# Altium schematic sheet Glucometer-E.C.- Full V1.SchDoc
size Letter
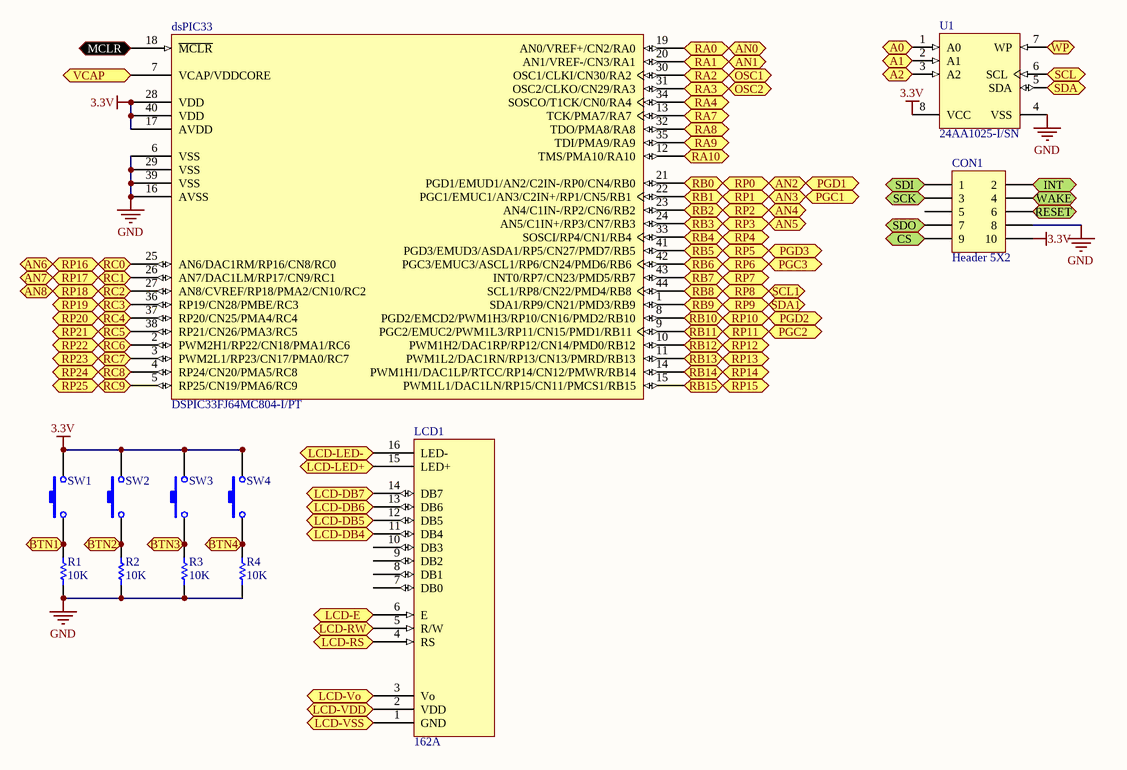
[diagram p0: Glucometer-E.C.- Full V1.SchDoc]

## Parts
CON1  Header 5X2  [HDR2X5]
dsPIC33  DSPIC33FJ64MC804-I/PT  [TQFP-PT44_N]
LCD1  162A  [162A]
R1  value 10K  [AXIAL-0.3]  (hidden comment: Res1)
R2  value 10K  [AXIAL-0.3]  (hidden comment: Res1)
R3  value 10K  [AXIAL-0.3]  (hidden comment: Res1)
R4  value 10K  [AXIAL-0.3]  (hidden comment: Res1)
SW1  SW-PB  [SPST-2]  (value not drawn)
SW2  SW-PB  [SPST-2]  (value not drawn)
SW3  SW-PB  [SPST-2]  (value not drawn)
SW4  SW-PB  [SPST-2]  (value not drawn)
U1  24AA1025-I/SN  [SOIC-SN8_N]

## Ports
A0, A1, A2, AN0, AN1, AN2, AN3, AN4, AN5, AN6, AN7, AN8, BTN1, BTN2, BTN3, BTN4, CS, INT, LCD-DB4, LCD-DB5, LCD-DB6, LCD-DB7, LCD-E, LCD-LED+, LCD-LED-, LCD-RS, LCD-RW, LCD-VDD, LCD-Vo, LCD-VSS, MCLR, OSC1, OSC2, PGC1, PGC2, PGC3, PGD1, PGD2, PGD3, RA0, RA1, RA2, RA3, RA4, RA7, RA8, RA9, RA10, RB0, RB1, RB2, RB3, RB4, RB5, RB6, RB7, RB8, RB9, RB10, RB11, RB12, RB13, RB14, RB15, RC0, RC1, RC2, RC3, RC4, RC5, RC6, RC7, RC8, RC9, RESET, RP0, RP1, RP2, RP3, RP4, RP5, RP6, RP7, RP8, RP9, RP10, RP11, RP12, RP13, RP14, RP15, RP16, RP17, RP18, RP19, RP20, RP21, RP22, RP23, RP24, RP25, SCK, SCL, SCL1, SDA, SDA1, SDI, SDO, VCAP, WAKE, WP

## Nets
3.3V: CON1.10 dsPIC33.17(AVDD) dsPIC33.28(VDD) dsPIC33.40(VDD) SW1.2 SW2.2 SW3.2 SW4.2 U1.8(VCC)
GND: CON1.8 dsPIC33.6(VSS) dsPIC33.16(AVSS) dsPIC33.29(VSS) dsPIC33.39(VSS) R1.1 R2.1 R3.1 R4.1 U1.4(VSS)
A0: U1.1(A0) ; port A0
A1: U1.2(A1) ; port A1
A2: U1.3(A2) ; port A2
AN0: dsPIC33.19(AN0/VREF+/CN2/RA0) ; port RA0, port AN0
AN1: dsPIC33.20(AN1/VREF-/CN3/RA1) ; port RA1, port AN1
AN2: dsPIC33.21(PGD1/EMUD1/AN2/C2IN-/RP0/CN4/RB0) ; port RB0, port PGD1, port AN2, port RP0
AN3: dsPIC33.22(PGC1/EMUC1/AN3/C2IN+/RP1/CN5/RB1) ; port RB1, port PGC1, port AN3, port RP1
AN4: dsPIC33.23(AN4/C1IN-/RP2/CN6/RB2) ; port RB2, port AN4, port RP2
AN5: dsPIC33.24(AN5/C1IN+/RP3/CN7/RB3) ; port RB3, port AN5, port RP3
AN6: dsPIC33.25(AN6/DAC1RM/RP16/CN8/RC0) ; port RC0, port RP16, port AN6
AN7: dsPIC33.26(AN7/DAC1LM/RP17/CN9/RC1) ; port RC1, port RP17, port AN7
AN8: dsPIC33.27(AN8/CVREF/RP18/PMA2/CN10/RC2) ; port RC2, port RP18, port AN8
BTN1: R1.2 SW1.1 ; port BTN1
BTN2: R2.2 SW2.1 ; port BTN2
BTN3: R3.2 SW3.1 ; port BTN3
BTN4: R4.2 SW4.1 ; port BTN4
CS: CON1.9 ; port CS
INT: CON1.2 ; port INT
LCD-DB4: LCD1.11(DB4) ; port LCD-DB4
LCD-DB5: LCD1.12(DB5) ; port LCD-DB5
LCD-DB6: LCD1.13(DB6) ; port LCD-DB6
LCD-DB7: LCD1.14(DB7) ; port LCD-DB7
LCD-E: LCD1.6(E) ; port LCD-E
LCD-LED+: LCD1.15(LED+) ; port LCD-LED+
LCD-LED-: LCD1.16(LED-) ; port LCD-LED-
LCD-RS: LCD1.4(RS) ; port LCD-RS
LCD-RW: LCD1.5(R/W) ; port LCD-RW
LCD-VDD: LCD1.2(VDD) ; port LCD-VDD
LCD-Vo: LCD1.3(Vo) ; port LCD-Vo
LCD-VSS: LCD1.1(GND) ; port LCD-VSS
MCLR: dsPIC33.18(~{MCLR}) ; port MCLR
OSC1: dsPIC33.30(OSC1/CLKI/CN30/RA2) ; port RA2, port OSC1
OSC2: dsPIC33.31(OSC2/CLKO/CN29/RA3) ; port RA3, port OSC2
PGC2: dsPIC33.9(PGC2/EMUC2/PWM1L3/RP11/CN15/PMD1/RB11) ; port RB11, port RP11, port PGC2
PGC3: dsPIC33.42(PGC3/EMUC3/ASCL1/RP6/CN24/PMD6/RB6) ; port RB6, port RP6, port PGC3
PGD2: dsPIC33.8(PGD2/EMCD2/PWM1H3/RP10/CN16/PMD2/RB10) ; port RB10, port RP10, port PGD2
PGD3: dsPIC33.41(PGD3/EMUD3/ASDA1/RP5/CN27/PMD7/RB5) ; port RB5, port RP5, port PGD3
RA4: dsPIC33.34(SOSCO/T1CK/CN0/RA4) ; port RA4
RA7: dsPIC33.13(TCK/PMA7/RA7) ; port RA7
RA8: dsPIC33.32(TDO/PMA8/RA8) ; port RA8
RA9: dsPIC33.35(TDI/PMA9/RA9) ; port RA9
RA10: dsPIC33.12(TMS/PMA10/RA10) ; port RA10
RB4: dsPIC33.33(SOSCI/RP4/CN1/RB4) ; port RB4, port RP4
RB7: dsPIC33.43(INT0/RP7/CN23/PMD5/RB7) ; port RB7, port RP7
RB8: dsPIC33.44(SCL1/RP8/CN22/PMD4/RB8) ; port RB8, port RP8, port SCL1
RB9: dsPIC33.1(SDA1/RP9/CN21/PMD3/RB9) ; port RB9, port RP9, port SDA1
RB12: dsPIC33.10(PWM1H2/DAC1RP/RP12/CN14/PMD0/RB12) ; port RB12, port RP12
RB13: dsPIC33.11(PWM1L2/DAC1RN/RP13/CN13/PMRD/RB13) ; port RB13, port RP13
RB14: dsPIC33.14(PWM1H1/DAC1LP/RTCC/RP14/CN12/PMWR/RB14) ; port RB14, port RP14
RB15: dsPIC33.15(PWM1L1/DAC1LN/RP15/CN11/PMCS1/RB15) ; port RB15, port RP15
RC3: dsPIC33.36(RP19/CN28/PMBE/RC3) ; port RC3, port RP19
RC4: dsPIC33.37(RP20/CN25/PMA4/RC4) ; port RC4, port RP20
RC5: dsPIC33.38(RP21/CN26/PMA3/RC5) ; port RC5, port RP21
RC6: dsPIC33.2(PWM2H1/RP22/CN18/PMA1/RC6) ; port RC6, port RP22
RC7: dsPIC33.3(PWM2L1/RP23/CN17/PMA0/RC7) ; port RC7, port RP23
RC8: dsPIC33.4(RP24/CN20/PMA5/RC8) ; port RC8, port RP24
RC9: dsPIC33.5(RP25/CN19/PMA6/RC9) ; port RC9, port RP25
RESET: CON1.6 ; port RESET
SCK: CON1.3 ; port SCK
SCL: U1.6(SCL) ; port SCL
SDA: U1.5(SDA) ; port SDA
SDI: CON1.1 ; port SDI
SDO: CON1.7 ; port SDO
VCAP: dsPIC33.7(VCAP/VDDCORE) ; port VCAP
WAKE: CON1.4 ; port WAKE
WP: U1.7(WP) ; port WP

Not connected (* = marked no-connect by the designer): CON1 5; LCD1 7(DB0) 8(DB1) 9(DB2) 10(DB3)

## Library data of the parts
CON1 = Header 5X2: Header, 5-Pin, Dual row; LatestRevisionDate: 17-Jul-2002; LatestRevisionNote: Re-released for DXP Platform.; Publisher: Altium Limited
dsPIC33 = DSPIC33FJ64MC804-I/PT: High-Performance 16-bit Digital Signal Controller, 64 KB Flash, 16 KB RAM, 44-Pin TQFP, Industrial Temperature; Published: 2-Dec-2009; DatasheetVersion: revD, Nov-2009; PackageVersion: revBB, Aug-2009; PackageReference: TQFP-PT44; Publisher: Altium Limited; PackageDescription: 44-Lead Plastic Thin Quad Flatpack (PT) - 10x10x1mm Body, 2.00mm [TQFP]; Supplier 1: Digi-Key; Supplier Part Number 1: DSPIC33FJ64MC804-I/PT-ND; Supplier 2: Farnell; Supplier Part Number 2: 1576844; Code_JEDEC: MS-026; ComponentLink1Description: Datasheet; ComponentLink1URL: http://ww1.microchip.com/downloads/en/DeviceDoc/70291D.pdf; ComponentLink2Description: Packaging Specification; ComponentLink2URL: http://www.microchip.com/stellent/groups/techpub_sg/documents/packagingspec/en012702.pdf; ComponentLink3Description: Microchip.com Home; ComponentLink3URL: http://www.microchip.com/
LCD1 = 162A: 16 char * 2 line LCD character display with b/light
R1-R4 = Res1: Resistor; Published: 8-Jun-2000; LatestRevisionDate: 17-Jul-2002; LatestRevisionNote: Re-released for DXP Platform.; PackageReference: AXIAL-0.3; Publisher: Altium Limited; PackageDescription: Axial Device, Thru-Hole; 2 Leads; 0.3 in Pin Spacing
SW1-SW4 = SW-PB: Switch; Published: 24-Mar-1999; LatestRevisionDate: 17-Jul-2002; LatestRevisionNote: Re-released for DXP Platform.; PackageReference: SPST-2; Publisher: Altium Limited; PackageDescription: Switch; 2 Leads
U1 = 24AA1025-I/SN: 1 Mbit, 400kHz, 1.7V, 8-Pin SOIC 150mil, Industrial Temperature; Published: 2-Dec-2009; DatasheetVersion: revF, Oct-2008; PackageVersion: revBB, Aug-2009; PackageReference: SOIC-SN8; Publisher: Altium Limited; PackageDescription: 8-Lead Plastic Small Outline (SN) - Narrow, 3.90mm Body [SOIC]; Supplier 1: Digi-Key; Supplier Part Number 1: 24AA1025-I/SN-ND; Code_JEDEC: MS-012; Code_IPC: SOIC127P600-8; ComponentLink1Description: Datasheet; ComponentLink1URL: http://ww1.microchip.com/downloads/en/DeviceDoc/21941F.pdf; ComponentLink2Description: Packaging Specification; ComponentLink2URL: http://www.microchip.com/stellent/groups/techpub_sg/documents/packagingspec/en012702.pdf; ComponentLink3Description: Microchip.com Home; ComponentLink3URL: http://www.microchip.com/